# Altium schematic sheet ConfigMultiplexer.SchDoc
size A4; SheetNumber: 5; SheetTotal: 10
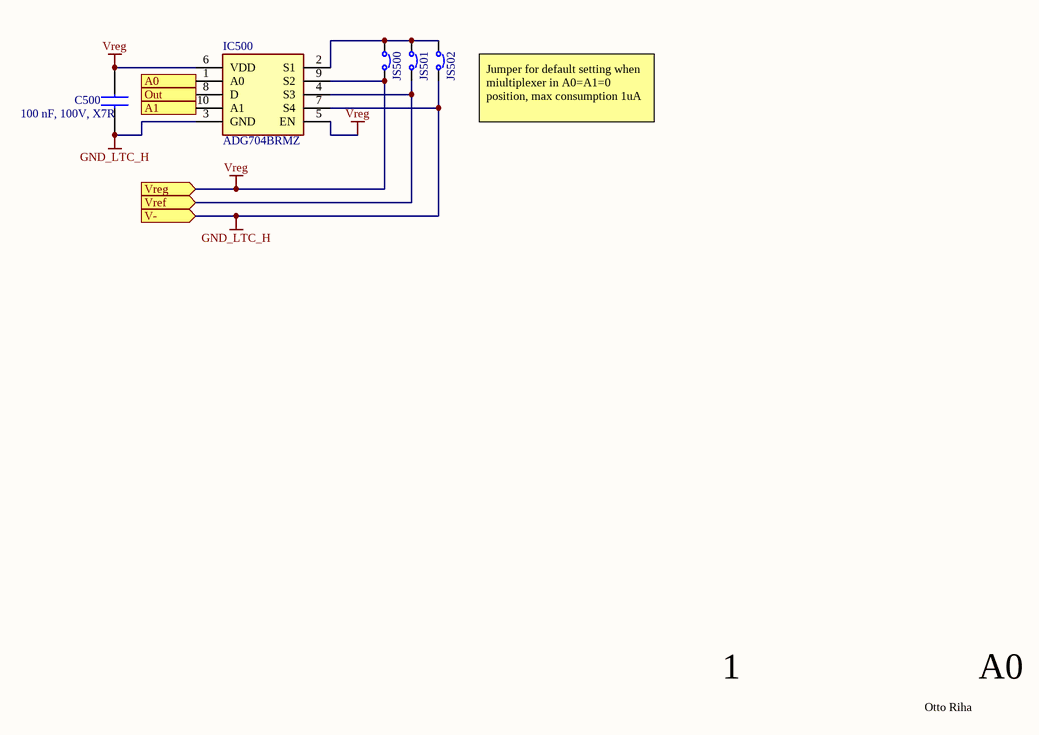
[diagram p0: ConfigMultiplexer.SchDoc]

## Parts
C500  100 nF, 100V, X7R  [MAJx16]
IC500  ADG704BRMZ  [SOP50P490X110-10N]
JS500  SolderJumper  [SolderJumper]  (value not drawn)
JS501  SolderJumper  [SolderJumper]  (value not drawn)
JS502  SolderJumper  [SolderJumper]  (value not drawn)

## Ports
A0 (in, see LTC_Hardware[3A]), A1 (in, see LTC_Hardware[3B]), Out (out, see LTC_Hardware[3B]), V- (in, see LTC_Hardware[3B]), Vref (in, see LTC_Hardware[3B]), Vreg (in, see LTC_Hardware[3A])

## Nets
GND_LTC_H: C500.1 IC500.3(GND) IC500.7(S4) JS502.1 ; port V-
Vreg: C500.2 IC500.5(EN) IC500.6(VDD) IC500.9(S2) JS500.1 ; port Vreg
A0: IC500.1(A0) ; port A0
A1: IC500.10(A1) ; port A1
Out: IC500.8(D) ; port Out
Vref: IC500.4(S3) JS501.1 ; port Vref
NetIC500_2: IC500.2(S1) JS500.2 JS501.2 JS502.2

## Notes on the sheet
- (near JS502) Jumper for default setting when miultiplexer in A0=A1=0 position, max consumption 1uA
- 1
- A0
- Otto Riha

## Library data of the parts
C500 = MAJCH168BB7104KTEA01: Capacitor 100nF, 100V, X7R; Manufacturer_Name: TAIYO YUDEN; Datasheet Link: https://ds.yuden.co.jp/TYCOMPAS/or/detail?pn=MAJCH168BB7104KTEA01; Height: 0.8mm; Manufacturer_Part_Number: MAJCH168BB7104KTEA01; Mouser Part Number: 963-MAJCH168BB7104KT; Mouser Price/Stock: https://www.mouser.co.uk/ProductDetail/TAIYO-YUDEN/MAJCH168BB7104KTEA01?qs=ZcfC38r4PovaTBrG0IdezQ%3D%3D; Arrow Part Number: MAJCH168BB7104KTEA01; Arrow Price/Stock: https://www.arrow.com/en/products/majch168bb7104ktea01/taiyo-yuden?utm_currency=USD&region=nac; Supplier 1: Mouser; Supplier Part Number 1: 963-MAJCH168BB7104KT
IC500 = ADG704BRMZ: Integrated Circuit; Manufacturer_Name: Analog Devices; Datasheet Link: https://datasheet.datasheetarchive.com/originals/distributors/Datasheets-4/DSA-69549.pdf; Height: 1.1mm; Manufacturer_Part_Number: ADG704BRMZ; Mouser Part Number: 584-ADG704BRMZ; Mouser Price/Stock: https://www.mouser.co.uk/ProductDetail/Analog-Devices/ADG704BRMZ?qs=BpaRKvA4VqEkN1EGAKO1Aw%3D%3D; Arrow Part Number: ADG704BRMZ; Arrow Price/Stock: https://www.arrow.com/en/products/adg704brmz/analog-devices?utm_currency=USD&region=nac